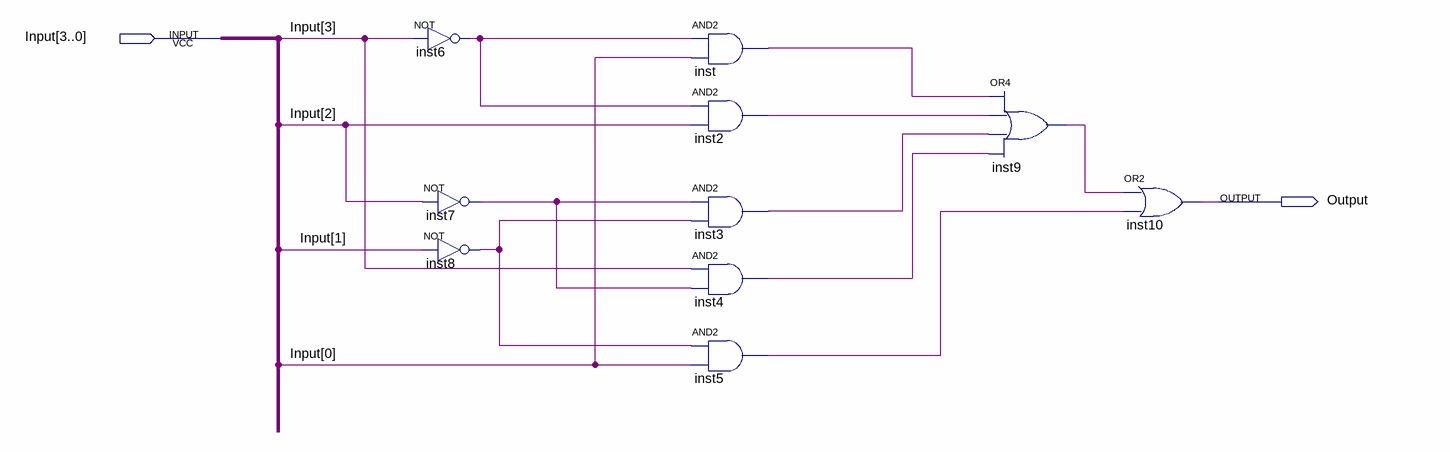
[diagram p0: schematic sheet]
// Quartus schematic display_c.bdf as structural Verilog: 10 symbols, 2 pins
module display_c (
  input  [3:0] Input,
  output Output
);

  wire inst2_out, inst3_out, inst4_out, inst5_out, inst6_out, inst7_out, inst8_out, inst9_out, inst_out;

  not inst6 (inst6_out, Input[3]);
  not inst7 (inst7_out, Input[2]);
  not inst8 (inst8_out, Input[1]);
  and inst (inst_out, inst6_out, Input[0]);
  and inst2 (inst2_out, inst6_out, Input[2]);
  and inst3 (inst3_out, inst7_out, inst8_out);
  and inst4 (inst4_out, Input[3], inst7_out);
  and inst5 (inst5_out, inst8_out, Input[0]);
  or inst9 (inst9_out, inst_out, inst2_out, inst3_out, inst4_out);
  or inst10 (Output, inst9_out, inst5_out);
endmodule
